# Altium schematic sheet Sheet1.SchDoc
size 863 x 558 mm; SheetNumber: 1; SheetTotal: 1
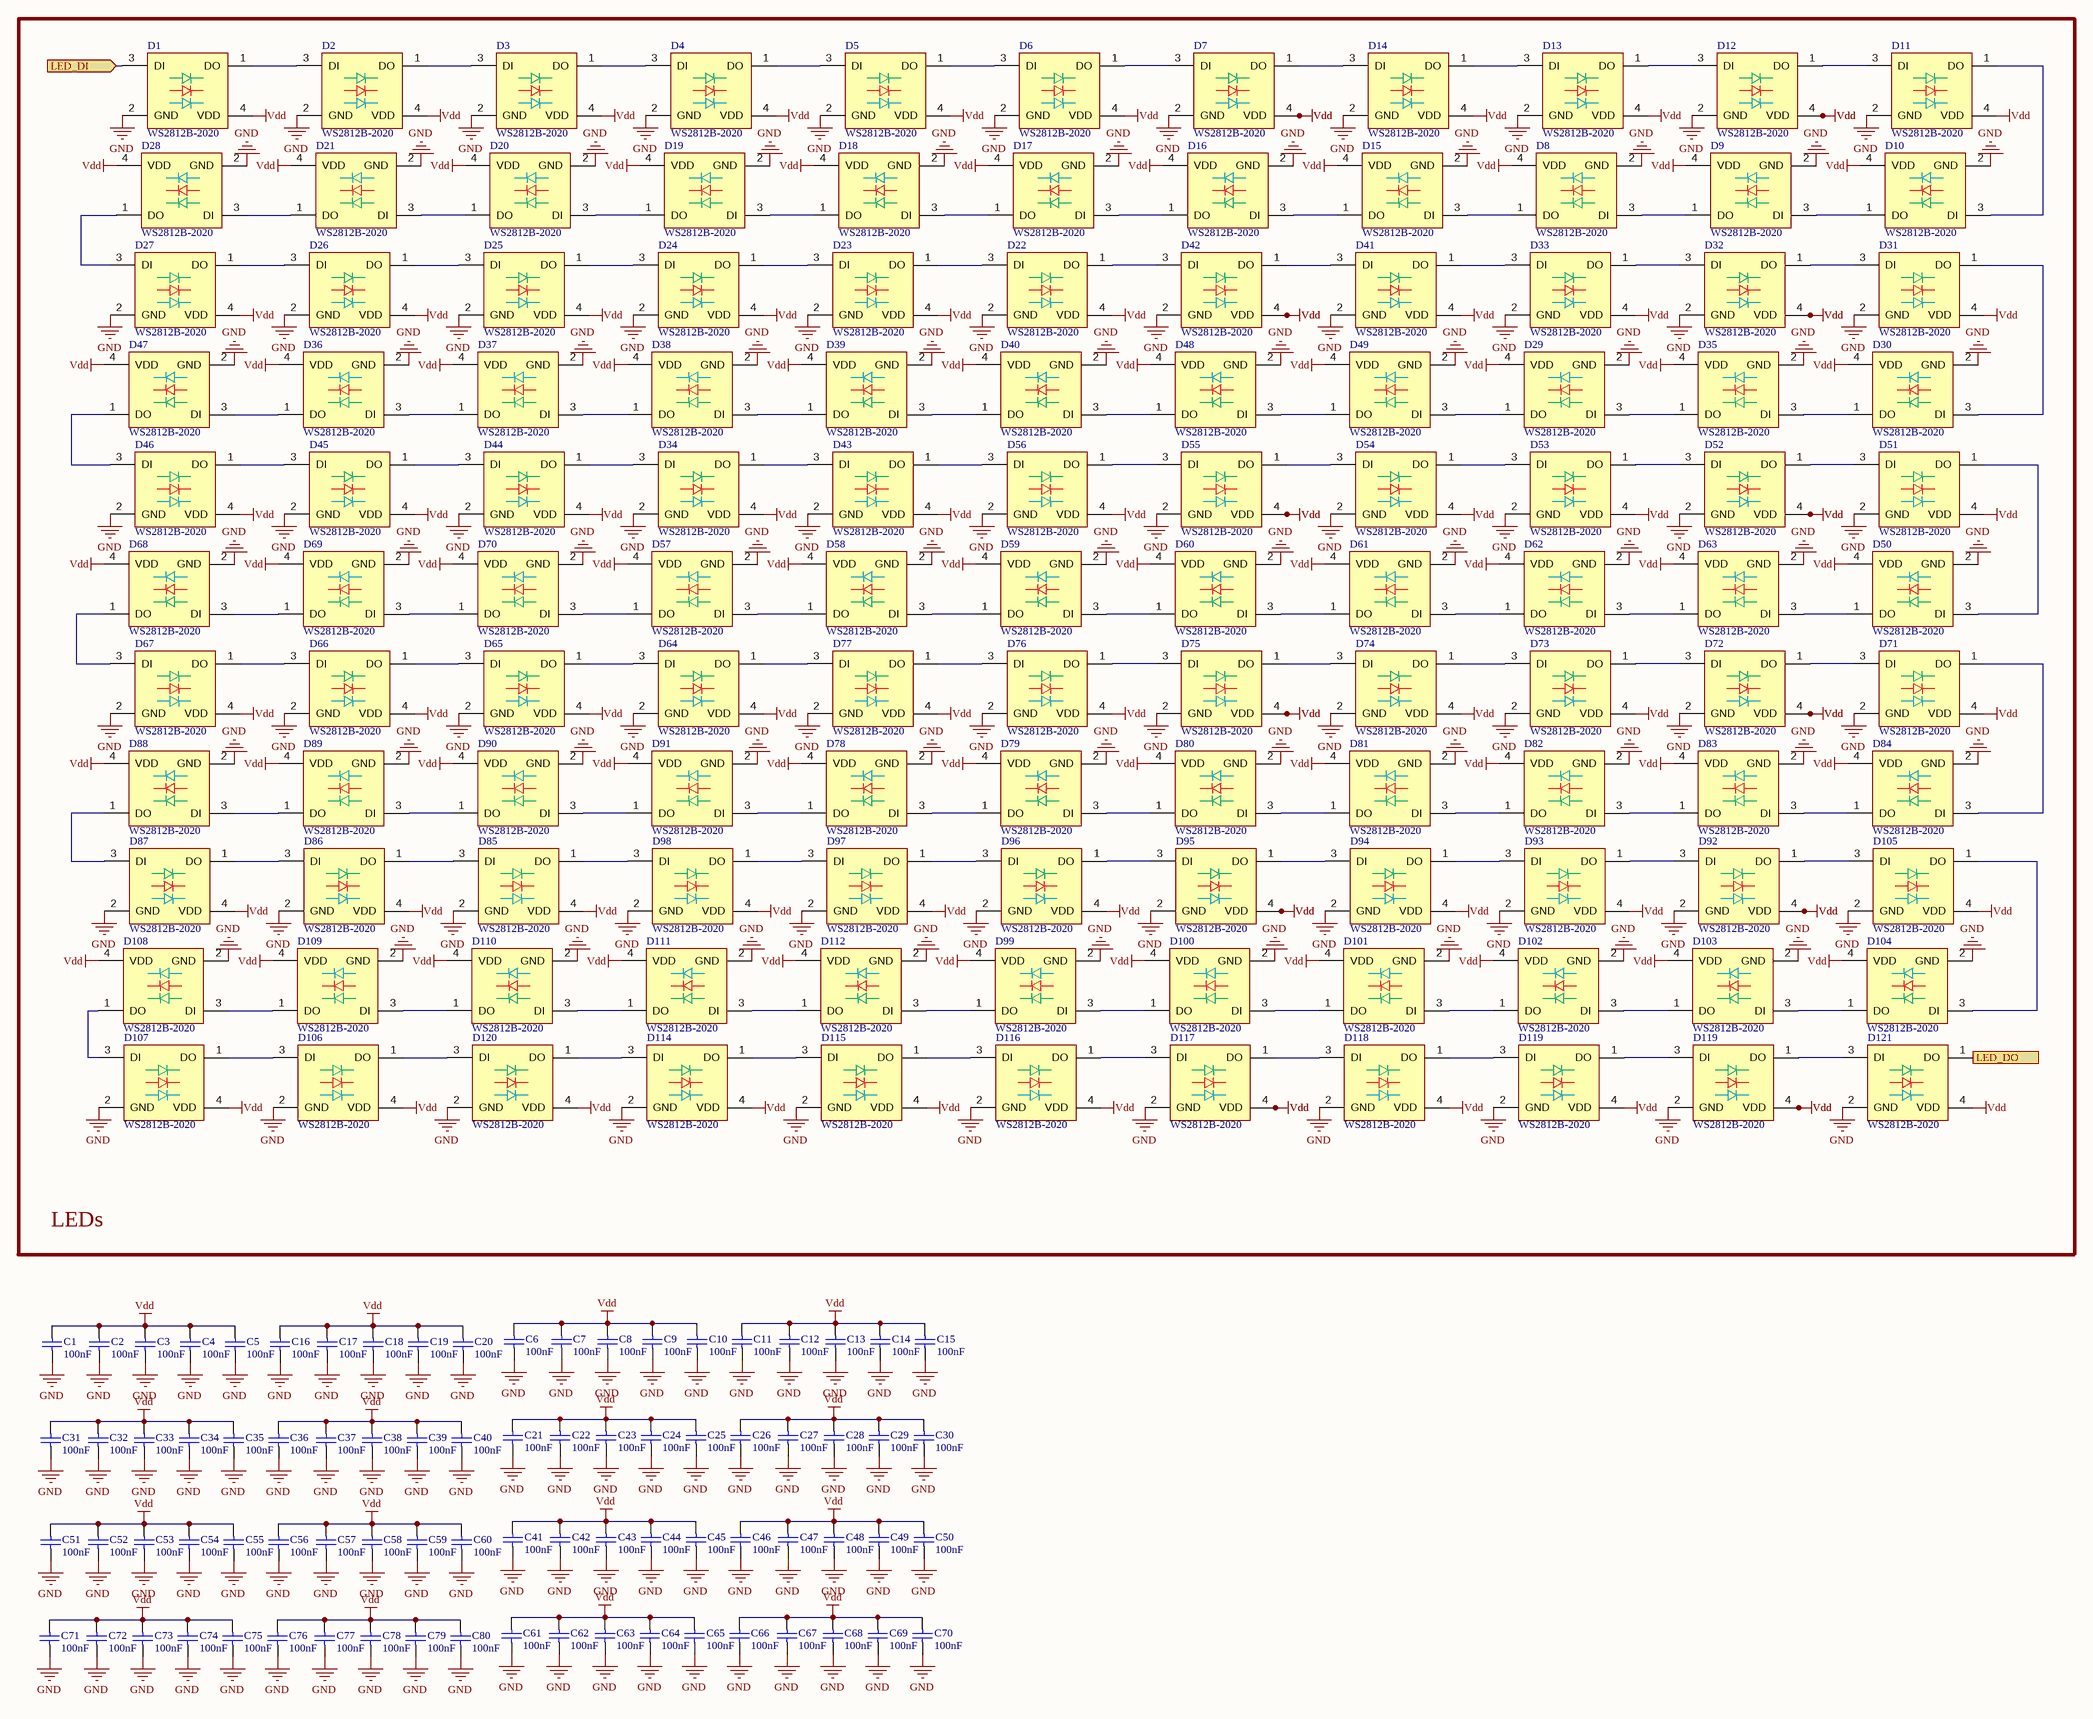
[diagram p0: Sheet1.SchDoc]

## Parts
(Parts that share a designator on the sheet are numbered #1, #2 ... from top to bottom, then left to right.)
C1  100nF  [RESC1005X03N]
C2  100nF  [RESC1005X03N]
C3  100nF  [RESC1005X03N]
C4  100nF  [RESC1005X03N]
C5  100nF  [RESC1005X03N]
C6  100nF  [RESC1005X03N]
C7  100nF  [RESC1005X03N]
C8  100nF  [RESC1005X03N]
C9  100nF  [RESC1005X03N]
C10  100nF  [RESC1005X03N]
C11  100nF  [RESC1005X03N]
C12  100nF  [RESC1005X03N]
C13  100nF  [RESC1005X03N]
C14  100nF  [RESC1005X03N]
C15  100nF  [RESC1005X03N]
C16  100nF  [RESC1005X03N]
C17  100nF  [RESC1005X03N]
C18  100nF  [RESC1005X03N]
C19  100nF  [RESC1005X03N]
C20  100nF  [RESC1005X03N]
C21  100nF  [RESC1005X03N]
C22  100nF  [RESC1005X03N]
C23  100nF  [RESC1005X03N]
C24  100nF  [RESC1005X03N]
C25  100nF  [RESC1005X03N]
C26  100nF  [RESC1005X03N]
C27  100nF  [RESC1005X03N]
C28  100nF  [RESC1005X03N]
C29  100nF  [RESC1005X03N]
C30  100nF  [RESC1005X03N]
C31  100nF  [RESC1005X03N]
C32  100nF  [RESC1005X03N]
C33  100nF  [RESC1005X03N]
C34  100nF  [RESC1005X03N]
C35  100nF  [RESC1005X03N]
C36  100nF  [RESC1005X03N]
C37  100nF  [RESC1005X03N]
C38  100nF  [RESC1005X03N]
C39  100nF  [RESC1005X03N]
C40  100nF  [RESC1005X03N]
C41  100nF  [RESC1005X03N]
C42  100nF  [RESC1005X03N]
C43  100nF  [RESC1005X03N]
C44  100nF  [RESC1005X03N]
C45  100nF  [RESC1005X03N]
C46  100nF  [RESC1005X03N]
C47  100nF  [RESC1005X03N]
C48  100nF  [RESC1005X03N]
C49  100nF  [RESC1005X03N]
C50  100nF  [RESC1005X03N]
C51  100nF  [RESC1005X03N]
C52  100nF  [RESC1005X03N]
C53  100nF  [RESC1005X03N]
C54  100nF  [RESC1005X03N]
C55  100nF  [RESC1005X03N]
C56  100nF  [RESC1005X03N]
C57  100nF  [RESC1005X03N]
C58  100nF  [RESC1005X03N]
C59  100nF  [RESC1005X03N]
C60  100nF  [RESC1005X03N]
C61  100nF  [RESC1005X03N]
C62  100nF  [RESC1005X03N]
C63  100nF  [RESC1005X03N]
C64  100nF  [RESC1005X03N]
C65  100nF  [RESC1005X03N]
C66  100nF  [RESC1005X03N]
C67  100nF  [RESC1005X03N]
C68  100nF  [RESC1005X03N]
C69  100nF  [RESC1005X03N]
C70  100nF  [RESC1005X03N]
C71  100nF  [RESC1005X03N]
C72  100nF  [RESC1005X03N]
C73  100nF  [RESC1005X03N]
C74  100nF  [RESC1005X03N]
C75  100nF  [RESC1005X03N]
C76  100nF  [RESC1005X03N]
C77  100nF  [RESC1005X03N]
C78  100nF  [RESC1005X03N]
C79  100nF  [RESC1005X03N]
C80  100nF  [RESC1005X03N]
D1  WS2812B-2020  [CAF-100P200X220-4N]
D2  WS2812B-2020  [CAF-100P200X220-4N]
D3  WS2812B-2020  [CAF-100P200X220-4N]
D4  WS2812B-2020  [CAF-100P200X220-4N]
D5  WS2812B-2020  [CAF-100P200X220-4N]
D6  WS2812B-2020  [CAF-100P200X220-4N]
D7  WS2812B-2020  [CAF-100P200X220-4N]
D8  WS2812B-2020  [CAF-100P200X220-4N]
D9  WS2812B-2020  [CAF-100P200X220-4N]
D10  WS2812B-2020  [CAF-100P200X220-4N]
D11  WS2812B-2020  [CAF-100P200X220-4N]
D12  WS2812B-2020  [CAF-100P200X220-4N]
D13  WS2812B-2020  [CAF-100P200X220-4N]
D14  WS2812B-2020  [CAF-100P200X220-4N]
D15  WS2812B-2020  [CAF-100P200X220-4N]
D16  WS2812B-2020  [CAF-100P200X220-4N]
D17  WS2812B-2020  [CAF-100P200X220-4N]
D18  WS2812B-2020  [CAF-100P200X220-4N]
D19  WS2812B-2020  [CAF-100P200X220-4N]
D20  WS2812B-2020  [CAF-100P200X220-4N]
D21  WS2812B-2020  [CAF-100P200X220-4N]
D22  WS2812B-2020  [CAF-100P200X220-4N]
D23  WS2812B-2020  [CAF-100P200X220-4N]
D24  WS2812B-2020  [CAF-100P200X220-4N]
D25  WS2812B-2020  [CAF-100P200X220-4N]
D26  WS2812B-2020  [CAF-100P200X220-4N]
D27  WS2812B-2020  [CAF-100P200X220-4N]
D28  WS2812B-2020  [CAF-100P200X220-4N]
D29  WS2812B-2020  [CAF-100P200X220-4N]
D30  WS2812B-2020  [CAF-100P200X220-4N]
D31  WS2812B-2020  [CAF-100P200X220-4N]
D32  WS2812B-2020  [CAF-100P200X220-4N]
D33  WS2812B-2020  [CAF-100P200X220-4N]
D34  WS2812B-2020  [CAF-100P200X220-4N]
D35  WS2812B-2020  [CAF-100P200X220-4N]
D36  WS2812B-2020  [CAF-100P200X220-4N]
D37  WS2812B-2020  [CAF-100P200X220-4N]
D38  WS2812B-2020  [CAF-100P200X220-4N]
D39  WS2812B-2020  [CAF-100P200X220-4N]
D40  WS2812B-2020  [CAF-100P200X220-4N]
D41  WS2812B-2020  [CAF-100P200X220-4N]
D42  WS2812B-2020  [CAF-100P200X220-4N]
D43  WS2812B-2020  [CAF-100P200X220-4N]
D44  WS2812B-2020  [CAF-100P200X220-4N]
D45  WS2812B-2020  [CAF-100P200X220-4N]
D46  WS2812B-2020  [CAF-100P200X220-4N]
D47  WS2812B-2020  [CAF-100P200X220-4N]
D48  WS2812B-2020  [CAF-100P200X220-4N]
D49  WS2812B-2020  [CAF-100P200X220-4N]
D50  WS2812B-2020  [CAF-100P200X220-4N]
D51  WS2812B-2020  [CAF-100P200X220-4N]
D52  WS2812B-2020  [CAF-100P200X220-4N]
D53  WS2812B-2020  [CAF-100P200X220-4N]
D54  WS2812B-2020  [CAF-100P200X220-4N]
D55  WS2812B-2020  [CAF-100P200X220-4N]
D56  WS2812B-2020  [CAF-100P200X220-4N]
D57  WS2812B-2020  [CAF-100P200X220-4N]
D58  WS2812B-2020  [CAF-100P200X220-4N]
D59  WS2812B-2020  [CAF-100P200X220-4N]
D60  WS2812B-2020  [CAF-100P200X220-4N]
D61  WS2812B-2020  [CAF-100P200X220-4N]
D62  WS2812B-2020  [CAF-100P200X220-4N]
D63  WS2812B-2020  [CAF-100P200X220-4N]
D64  WS2812B-2020  [CAF-100P200X220-4N]
D65  WS2812B-2020  [CAF-100P200X220-4N]
D66  WS2812B-2020  [CAF-100P200X220-4N]
D67  WS2812B-2020  [CAF-100P200X220-4N]
D68  WS2812B-2020  [CAF-100P200X220-4N]
D69  WS2812B-2020  [CAF-100P200X220-4N]
D70  WS2812B-2020  [CAF-100P200X220-4N]
D71  WS2812B-2020  [CAF-100P200X220-4N]
D72  WS2812B-2020  [CAF-100P200X220-4N]
D73  WS2812B-2020  [CAF-100P200X220-4N]
D74  WS2812B-2020  [CAF-100P200X220-4N]
D75  WS2812B-2020  [CAF-100P200X220-4N]
D76  WS2812B-2020  [CAF-100P200X220-4N]
D77  WS2812B-2020  [CAF-100P200X220-4N]
D78  WS2812B-2020  [CAF-100P200X220-4N]
D79  WS2812B-2020  [CAF-100P200X220-4N]
D80  WS2812B-2020  [CAF-100P200X220-4N]
D81  WS2812B-2020  [CAF-100P200X220-4N]
D82  WS2812B-2020  [CAF-100P200X220-4N]
D83  WS2812B-2020  [CAF-100P200X220-4N]
D84  WS2812B-2020  [CAF-100P200X220-4N]
D85  WS2812B-2020  [CAF-100P200X220-4N]
D86  WS2812B-2020  [CAF-100P200X220-4N]
D87  WS2812B-2020  [CAF-100P200X220-4N]
D88  WS2812B-2020  [CAF-100P200X220-4N]
D89  WS2812B-2020  [CAF-100P200X220-4N]
D90  WS2812B-2020  [CAF-100P200X220-4N]
D91  WS2812B-2020  [CAF-100P200X220-4N]
D92  WS2812B-2020  [CAF-100P200X220-4N]
D93  WS2812B-2020  [CAF-100P200X220-4N]
D94  WS2812B-2020  [CAF-100P200X220-4N]
D95  WS2812B-2020  [CAF-100P200X220-4N]
D96  WS2812B-2020  [CAF-100P200X220-4N]
D97  WS2812B-2020  [CAF-100P200X220-4N]
D98  WS2812B-2020  [CAF-100P200X220-4N]
D99  WS2812B-2020  [CAF-100P200X220-4N]
D100  WS2812B-2020  [CAF-100P200X220-4N]
D101  WS2812B-2020  [CAF-100P200X220-4N]
D102  WS2812B-2020  [CAF-100P200X220-4N]
D103  WS2812B-2020  [CAF-100P200X220-4N]
D104  WS2812B-2020  [CAF-100P200X220-4N]
D105  WS2812B-2020  [CAF-100P200X220-4N]
D106  WS2812B-2020  [CAF-100P200X220-4N]
D107  WS2812B-2020  [CAF-100P200X220-4N]
D108  WS2812B-2020  [CAF-100P200X220-4N]
D109  WS2812B-2020  [CAF-100P200X220-4N]
D110  WS2812B-2020  [CAF-100P200X220-4N]
D111  WS2812B-2020  [CAF-100P200X220-4N]
D112  WS2812B-2020  [CAF-100P200X220-4N]
D114  WS2812B-2020  [CAF-100P200X220-4N]
D115  WS2812B-2020  [CAF-100P200X220-4N]
D116  WS2812B-2020  [CAF-100P200X220-4N]
D117  WS2812B-2020  [CAF-100P200X220-4N]
D118  WS2812B-2020  [CAF-100P200X220-4N]
D119#1  WS2812B-2020  [CAF-100P200X220-4N]
D119#2  WS2812B-2020  [CAF-100P200X220-4N]
D120  WS2812B-2020  [CAF-100P200X220-4N]
D121  WS2812B-2020  [CAF-100P200X220-4N]

## Blocks framed on the sheet
LEDs: D1-D112 D114-D118 D119#1 D119#2 D120 D121

## Ports
LED_DI (in), LED_DO (in)

## Nets
GND: C1.2 C2.2 C3.2 C4.2 C5.2 C6.2 C7.2 C8.2 C9.2 C10.2 C11.2 C12.2 C13.2 C14.2 C15.2 C16.2 C17.2 C18.2 C19.2 C20.2 C21.2 C22.2 C23.2 C24.2 C25.2 C26.2 C27.2 C28.2 C29.2 C30.2 C31.2 C32.2 C33.2 C34.2 C35.2 C36.2 C37.2 C38.2 C39.2 C40.2 C41.2 C42.2 C43.2 C44.2 C45.2 C46.2 C47.2 C48.2 C49.2 C50.2 C51.2 C52.2 C53.2 C54.2 C55.2 C56.2 C57.2 C58.2 C59.2 C60.2 C61.2 C62.2 C63.2 C64.2 C65.2 C66.2 C67.2 C68.2 C69.2 C70.2 C71.2 C72.2 C73.2 C74.2 C75.2 C76.2 C77.2 C78.2 C79.2 C80.2 D1.2(GND) D2.2(GND) D3.2(GND) D4.2(GND) D5.2(GND) D6.2(GND) D7.2(GND) D8.2(GND) D9.2(GND) D10.2(GND) D11.2(GND) D12.2(GND) D13.2(GND) D14.2(GND) D15.2(GND) D16.2(GND) D17.2(GND) D18.2(GND) D19.2(GND) D20.2(GND) D21.2(GND) D22.2(GND) D23.2(GND) D24.2(GND) D25.2(GND) D26.2(GND) D27.2(GND) D28.2(GND) D29.2(GND) D30.2(GND) D31.2(GND) D32.2(GND) D33.2(GND) D34.2(GND) D35.2(GND) D36.2(GND) D37.2(GND) D38.2(GND) D39.2(GND) D40.2(GND) D41.2(GND) D42.2(GND) D43.2(GND) D44.2(GND) D45.2(GND) D46.2(GND) D47.2(GND) D48.2(GND) D49.2(GND) D50.2(GND) D51.2(GND) D52.2(GND) D53.2(GND) D54.2(GND) D55.2(GND) D56.2(GND) D57.2(GND) D58.2(GND) D59.2(GND) D60.2(GND) D61.2(GND) D62.2(GND) D63.2(GND) D64.2(GND) D65.2(GND) D66.2(GND) D67.2(GND) D68.2(GND) D69.2(GND) D70.2(GND) D71.2(GND) D72.2(GND) D73.2(GND) D74.2(GND) D75.2(GND) D76.2(GND) D77.2(GND) D78.2(GND) D79.2(GND) D80.2(GND) D81.2(GND) D82.2(GND) D83.2(GND) D84.2(GND) D85.2(GND) D86.2(GND) D87.2(GND) D88.2(GND) D89.2(GND) D90.2(GND) D91.2(GND) D92.2(GND) D93.2(GND) D94.2(GND) D95.2(GND) D96.2(GND) D97.2(GND) D98.2(GND) D99.2(GND) D100.2(GND) D101.2(GND) D102.2(GND) D103.2(GND) D104.2(GND) D105.2(GND) D106.2(GND) D107.2(GND) D108.2(GND) D109.2(GND) D110.2(GND) D111.2(GND) D112.2(GND) D114.2(GND) D115.2(GND) D116.2(GND) D117.2(GND) D118.2(GND) D119#1.2(GND) D119#2.2(GND) D120.2(GND) D121.2(GND)
Vdd: C1.1 C2.1 C3.1 C4.1 C5.1 C6.1 C7.1 C8.1 C9.1 C10.1 C11.1 C12.1 C13.1 C14.1 C15.1 C16.1 C17.1 C18.1 C19.1 C20.1 C21.1 C22.1 C23.1 C24.1 C25.1 C26.1 C27.1 C28.1 C29.1 C30.1 C31.1 C32.1 C33.1 C34.1 C35.1 C36.1 C37.1 C38.1 C39.1 C40.1 C41.1 C42.1 C43.1 C44.1 C45.1 C46.1 C47.1 C48.1 C49.1 C50.1 C51.1 C52.1 C53.1 C54.1 C55.1 C56.1 C57.1 C58.1 C59.1 C60.1 C61.1 C62.1 C63.1 C64.1 C65.1 C66.1 C67.1 C68.1 C69.1 C70.1 C71.1 C72.1 C73.1 C74.1 C75.1 C76.1 C77.1 C78.1 C79.1 C80.1 D1.4(VDD) D2.4(VDD) D3.4(VDD) D4.4(VDD) D5.4(VDD) D6.4(VDD) D7.4(VDD) D8.4(VDD) D9.4(VDD) D10.4(VDD) D11.4(VDD) D12.4(VDD) D13.4(VDD) D14.4(VDD) D15.4(VDD) D16.4(VDD) D17.4(VDD) D18.4(VDD) D19.4(VDD) D20.4(VDD) D21.4(VDD) D22.4(VDD) D23.4(VDD) D24.4(VDD) D25.4(VDD) D26.4(VDD) D27.4(VDD) D28.4(VDD) D29.4(VDD) D30.4(VDD) D31.4(VDD) D32.4(VDD) D33.4(VDD) D34.4(VDD) D35.4(VDD) D36.4(VDD) D37.4(VDD) D38.4(VDD) D39.4(VDD) D40.4(VDD) D41.4(VDD) D42.4(VDD) D43.4(VDD) D44.4(VDD) D45.4(VDD) D46.4(VDD) D47.4(VDD) D48.4(VDD) D49.4(VDD) D50.4(VDD) D51.4(VDD) D52.4(VDD) D53.4(VDD) D54.4(VDD) D55.4(VDD) D56.4(VDD) D57.4(VDD) D58.4(VDD) D59.4(VDD) D60.4(VDD) D61.4(VDD) D62.4(VDD) D63.4(VDD) D64.4(VDD) D65.4(VDD) D66.4(VDD) D67.4(VDD) D68.4(VDD) D69.4(VDD) D70.4(VDD) D71.4(VDD) D72.4(VDD) D73.4(VDD) D74.4(VDD) D75.4(VDD) D76.4(VDD) D77.4(VDD) D78.4(VDD) D79.4(VDD) D80.4(VDD) D81.4(VDD) D82.4(VDD) D83.4(VDD) D84.4(VDD) D85.4(VDD) D86.4(VDD) D87.4(VDD) D88.4(VDD) D89.4(VDD) D90.4(VDD) D91.4(VDD) D92.4(VDD) D93.4(VDD) D94.4(VDD) D95.4(VDD) D96.4(VDD) D97.4(VDD) D98.4(VDD) D99.4(VDD) D100.4(VDD) D101.4(VDD) D102.4(VDD) D103.4(VDD) D104.4(VDD) D105.4(VDD) D106.4(VDD) D107.4(VDD) D108.4(VDD) D109.4(VDD) D110.4(VDD) D111.4(VDD) D112.4(VDD) D114.4(VDD) D115.4(VDD) D116.4(VDD) D117.4(VDD) D118.4(VDD) D119#1.4(VDD) D119#2.4(VDD) D120.4(VDD) D121.4(VDD)
LED_DI: D1.3(DI) ; port LED_DI
LED_DO: D121.1(DO) ; port LED_DO
NetD1_1: D1.1(DO) D2.3(DI)
NetD2_1: D2.1(DO) D3.3(DI)
NetD3_1: D3.1(DO) D4.3(DI)
NetD4_1: D4.1(DO) D5.3(DI)
NetD5_1: D5.1(DO) D6.3(DI)
NetD6_1: D6.1(DO) D7.3(DI)
NetD7_1: D7.1(DO) D14.3(DI)
NetD8_1: D8.1(DO) D15.3(DI)
NetD8_3: D8.3(DI) D9.1(DO)
NetD9_3: D9.3(DI) D10.1(DO)
NetD10_3: D10.3(DI) D11.1(DO)
NetD11_3: D11.3(DI) D12.1(DO)
NetD12_3: D12.3(DI) D13.1(DO)
NetD13_3: D13.3(DI) D14.1(DO)
NetD15_1: D15.1(DO) D16.3(DI)
NetD16_1: D16.1(DO) D17.3(DI)
NetD17_1: D17.1(DO) D18.3(DI)
NetD18_1: D18.1(DO) D19.3(DI)
NetD19_1: D19.1(DO) D20.3(DI)
NetD20_1: D20.1(DO) D21.3(DI)
NetD21_1: D21.1(DO) D28.3(DI)
NetD22_1: D22.1(DO) D42.3(DI)
NetD22_3: D22.3(DI) D23.1(DO)
NetD23_3: D23.3(DI) D24.1(DO)
NetD24_3: D24.3(DI) D25.1(DO)
NetD25_3: D25.3(DI) D26.1(DO)
NetD26_3: D26.3(DI) D27.1(DO)
NetD27_3: D27.3(DI) D28.1(DO)
NetD29_1: D29.1(DO) D49.3(DI)
NetD29_3: D29.3(DI) D35.1(DO)
NetD30_1: D30.1(DO) D35.3(DI)
NetD30_3: D30.3(DI) D31.1(DO)
NetD31_3: D31.3(DI) D32.1(DO)
NetD32_3: D32.3(DI) D33.1(DO)
NetD33_3: D33.3(DI) D41.1(DO)
NetD34_1: D34.1(DO) D43.3(DI)
NetD34_3: D34.3(DI) D44.1(DO)
NetD36_1: D36.1(DO) D47.3(DI)
NetD36_3: D36.3(DI) D37.1(DO)
NetD37_3: D37.3(DI) D38.1(DO)
NetD38_3: D38.3(DI) D39.1(DO)
NetD39_3: D39.3(DI) D40.1(DO)
NetD40_3: D40.3(DI) D48.1(DO)
NetD41_3: D41.3(DI) D42.1(DO)
NetD43_1: D43.1(DO) D56.3(DI)
NetD44_3: D44.3(DI) D45.1(DO)
NetD45_3: D45.3(DI) D46.1(DO)
NetD46_3: D46.3(DI) D47.1(DO)
NetD48_3: D48.3(DI) D49.1(DO)
NetD50_1: D50.1(DO) D63.3(DI)
NetD50_3: D50.3(DI) D51.1(DO)
NetD51_3: D51.3(DI) D52.1(DO)
NetD52_3: D52.3(DI) D53.1(DO)
NetD53_3: D53.3(DI) D54.1(DO)
NetD54_3: D54.3(DI) D55.1(DO)
NetD55_3: D55.3(DI) D56.1(DO)
NetD57_1: D57.1(DO) D70.3(DI)
NetD57_3: D57.3(DI) D58.1(DO)
NetD58_3: D58.3(DI) D59.1(DO)
NetD59_3: D59.3(DI) D60.1(DO)
NetD60_3: D60.3(DI) D61.1(DO)
NetD61_3: D61.3(DI) D62.1(DO)
NetD62_3: D62.3(DI) D63.1(DO)
NetD64_1: D64.1(DO) D77.3(DI)
NetD64_3: D64.3(DI) D65.1(DO)
NetD65_3: D65.3(DI) D66.1(DO)
NetD66_3: D66.3(DI) D67.1(DO)
NetD67_3: D67.3(DI) D68.1(DO)
NetD68_3: D68.3(DI) D69.1(DO)
NetD69_3: D69.3(DI) D70.1(DO)
NetD71_1: D71.1(DO) D84.3(DI)
NetD71_3: D71.3(DI) D72.1(DO)
NetD72_3: D72.3(DI) D73.1(DO)
NetD73_3: D73.3(DI) D74.1(DO)
NetD74_3: D74.3(DI) D75.1(DO)
NetD75_3: D75.3(DI) D76.1(DO)
NetD76_3: D76.3(DI) D77.1(DO)
NetD78_1: D78.1(DO) D91.3(DI)
NetD78_3: D78.3(DI) D79.1(DO)
NetD79_3: D79.3(DI) D80.1(DO)
NetD80_3: D80.3(DI) D81.1(DO)
NetD81_3: D81.3(DI) D82.1(DO)
NetD82_3: D82.3(DI) D83.1(DO)
NetD83_3: D83.3(DI) D84.1(DO)
NetD85_1: D85.1(DO) D98.3(DI)
NetD85_3: D85.3(DI) D86.1(DO)
NetD86_3: D86.3(DI) D87.1(DO)
NetD87_3: D87.3(DI) D88.1(DO)
NetD88_3: D88.3(DI) D89.1(DO)
NetD89_3: D89.3(DI) D90.1(DO)
NetD90_3: D90.3(DI) D91.1(DO)
NetD92_1: D92.1(DO) D105.3(DI)
NetD92_3: D92.3(DI) D93.1(DO)
NetD93_3: D93.3(DI) D94.1(DO)
NetD94_3: D94.3(DI) D95.1(DO)
NetD95_3: D95.3(DI) D96.1(DO)
NetD96_3: D96.3(DI) D97.1(DO)
NetD97_3: D97.3(DI) D98.1(DO)
NetD99_1: D99.1(DO) D112.3(DI)
NetD99_3: D99.3(DI) D100.1(DO)
NetD100_3: D100.3(DI) D101.1(DO)
NetD101_3: D101.3(DI) D102.1(DO)
NetD102_3: D102.3(DI) D103.1(DO)
NetD103_3: D103.3(DI) D104.1(DO)
NetD104_3: D104.3(DI) D105.1(DO)
NetD106_1: D106.1(DO) D120.3(DI)
NetD106_3: D106.3(DI) D107.1(DO)
NetD107_3: D107.3(DI) D108.1(DO)
NetD108_3: D108.3(DI) D109.1(DO)
NetD109_3: D109.3(DI) D110.1(DO)
NetD110_3: D110.3(DI) D111.1(DO)
NetD111_3: D111.3(DI) D112.1(DO)
NetD114_1: D114.1(DO) D115.3(DI)
NetD114_3: D114.3(DI) D120.1(DO)
NetD115_1: D115.1(DO) D116.3(DI)
NetD116_1: D116.1(DO) D117.3(DI)
NetD117_1: D117.1(DO) D118.3(DI)
NetD118_1: D118.1(DO) D119#1.3(DI)
NetD119#1_1: D119#1.1(DO) D119#2.3(DI)
NetD119#2_1: D119#2.1(DO) D121.3(DI)

## Notes on the sheet
- DWG. NO.
- REV.
- SHT.
- REVISION
- DESCRIPTION
- DATE
- APPROVED
- THIS DOCUMENT AND THE DATA DISCLOSED HEREIN OR HEREWITH IS THE PROPERTY OF ALTIUM LIMITED AND MAY BE FREELY DISTRIBUTED IN WHOLE. NO RIGHTS ARE RESERVED OR EXPRESS OR IMPLIED WARANTEE GIVEN.
- ENG:
- DSN:
- APPROVALS
- PROJECT
- DOCUMENT REVISION:
- DESIGN ITEM:
- CHK:
- BOM:
- REFERENCE DOCUMENTS
- PROJECT REVISION:
- TITLE
- FAB DWG:
- PCB DWG:
- ASSY DWG:
- SCALE:
- SIZE
- D
- CAGE CODE
- FILE NAME
- DWG NO.
- SHEET
- OF
- REV

## Library data of the parts
C1-C80 = CAP